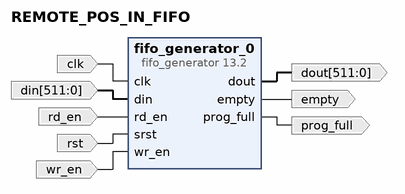
[diagram p0: block diagram of the top level]
# Vivado block design REMOTE_POS_IN_FIFO, xcu280-fsvh2892-2L-e, Vivado 2021.2
create_bd_design REMOTE_POS_IN_FIFO

create_bd_port -dir I rd_en
create_bd_port -dir O -from 511 -to 0 dout
create_bd_port -dir O empty
create_bd_port -dir I wr_en
create_bd_port -dir I -from 511 -to 0 din
create_bd_port -dir O prog_full
create_bd_port -dir I rst
create_bd_port -dir I -type clk clk

create_bd_cell -type ip -vlnv xilinx.com:ip:fifo_generator:13.2 fifo_generator_0
set_property -dict [list \
  CONFIG.Fifo_Implementation Common_Clock_Builtin_FIFO \
  CONFIG.Full_Threshold_Assert_Value 500 \
  CONFIG.Input_Data_Width 512 \
  CONFIG.Input_Depth 512 \
  CONFIG.Performance_Options First_Word_Fall_Through \
  CONFIG.Programmable_Full_Type Single_Programmable_Full_Threshold_Constant \
  CONFIG.Use_Embedded_Registers false \
] [get_bd_cells fifo_generator_0]

# ---- connections ----

connect_bd_net -net clk_0_1 [get_bd_ports clk] [get_bd_pins fifo_generator_0/clk]
connect_bd_net -net din_0_1 [get_bd_ports din] [get_bd_pins fifo_generator_0/din]
connect_bd_net [get_bd_pins fifo_generator_0/dout] [get_bd_ports dout]
connect_bd_net [get_bd_pins fifo_generator_0/empty] [get_bd_ports empty]
connect_bd_net [get_bd_pins fifo_generator_0/prog_full] [get_bd_ports prog_full]
connect_bd_net -net rd_en_0_1 [get_bd_ports rd_en] [get_bd_pins fifo_generator_0/rd_en]
connect_bd_net -net srst_0_1 [get_bd_ports rst] [get_bd_pins fifo_generator_0/srst]
connect_bd_net -net wr_en_0_1 [get_bd_ports wr_en] [get_bd_pins fifo_generator_0/wr_en]

validate_bd_design
save_bd_design
